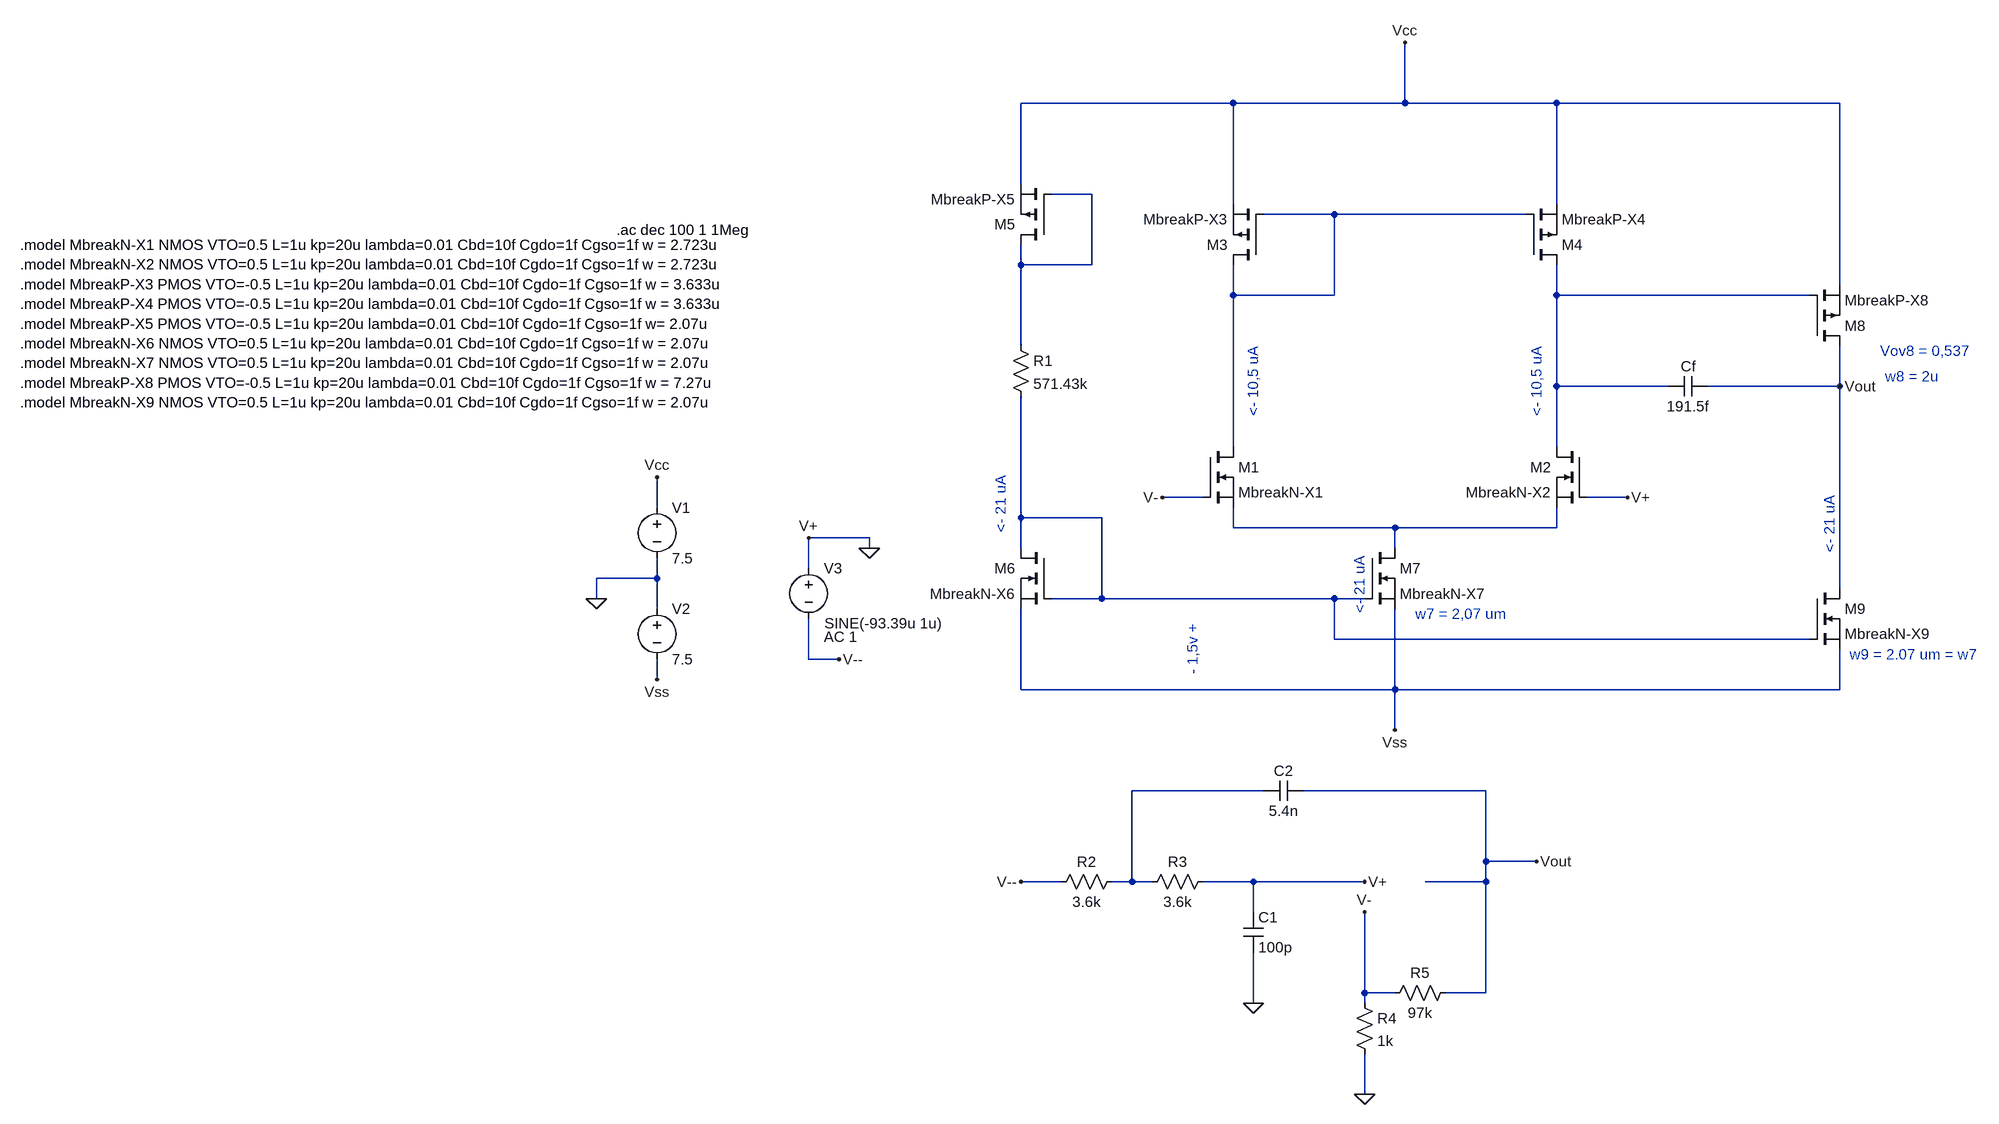
[diagram p0: schematic SIMULAÇÃO-Amp.op.Filtro.asc]
SIMULAÇÃO-Amp.op.Filtro.asc, the LTspice schematic file:
Version 4.1
SHEET 1 3020 948
WIRE 1216 -640 880 -640
WIRE 1488 -640 1488 -736
WIRE 1488 -640 1216 -640
WIRE 1728 -640 1488 -640
WIRE 2176 -640 1728 -640
WIRE 880 -512 880 -640
WIRE 992 -496 928 -496
WIRE 1216 -480 1216 -640
WIRE 1728 -480 1728 -640
WIRE 1376 -464 1264 -464
WIRE 1680 -464 1376 -464
WIRE 880 -384 880 -416
WIRE 992 -384 992 -496
WIRE 992 -384 880 -384
WIRE 2176 -352 2176 -640
WIRE 1216 -336 1216 -384
WIRE 1376 -336 1376 -464
WIRE 1376 -336 1216 -336
WIRE 1728 -336 1728 -384
WIRE 2128 -336 1728 -336
WIRE 880 -256 880 -384
WIRE 1728 -192 1728 -336
WIRE 1904 -192 1728 -192
WIRE 2176 -192 2176 -256
WIRE 2176 -192 1968 -192
WIRE 1216 -96 1216 -336
WIRE 1728 -96 1728 -192
WIRE 1168 -16 1104 -16
WIRE 1840 -16 1776 -16
WIRE 304 0 304 -48
WIRE 880 16 880 -176
WIRE 1008 16 880 16
WIRE 1216 32 1216 0
WIRE 1472 32 1216 32
WIRE 1728 32 1728 0
WIRE 1728 32 1472 32
WIRE 640 48 544 48
WIRE 640 64 640 48
WIRE 880 64 880 16
WIRE 1472 64 1472 32
WIRE 544 96 544 48
WIRE 304 112 304 80
WIRE 304 112 208 112
WIRE 2176 128 2176 -192
WIRE 208 144 208 112
WIRE 1008 144 1008 16
WIRE 1008 144 928 144
WIRE 1376 144 1008 144
WIRE 1424 144 1376 144
WIRE 304 160 304 112
WIRE 1376 208 1376 144
WIRE 2128 208 1376 208
WIRE 544 240 544 176
WIRE 592 240 544 240
WIRE 304 272 304 240
WIRE 880 288 880 160
WIRE 1472 288 1472 160
WIRE 1472 288 880 288
WIRE 2176 288 2176 224
WIRE 2176 288 1472 288
WIRE 1472 352 1472 288
WIRE 1264 448 1056 448
WIRE 1616 448 1328 448
WIRE 1616 560 1616 448
WIRE 1696 560 1616 560
WIRE 944 592 880 592
WIRE 1056 592 1056 448
WIRE 1056 592 1024 592
WIRE 1088 592 1056 592
WIRE 1248 592 1168 592
WIRE 1424 592 1248 592
WIRE 1616 592 1616 560
WIRE 1616 592 1520 592
WIRE 1248 640 1248 592
WIRE 1424 768 1424 640
WIRE 1472 768 1424 768
WIRE 1616 768 1616 592
WIRE 1616 768 1552 768
WIRE 1248 784 1248 704
WIRE 1424 784 1424 768
WIRE 1424 928 1424 864
FLAG 304 -48 Vcc
FLAG 304 272 Vss
FLAG 208 144 0
FLAG 592 240 V--
FLAG 544 48 V+
FLAG 1840 -16 V+
FLAG 1104 -16 V-
FLAG 1488 -736 Vcc
FLAG 1472 352 Vss
FLAG 640 64 0
FLAG 880 592 V--
FLAG 1248 784 0
FLAG 1424 928 0
FLAG 1424 592 V+
FLAG 1424 640 V-
FLAG 2176 -192 Vout
FLAG 1696 560 Vout
DATAFLAG 2176 -160 ""
SYMBOL voltage 304 -16 R0
WINDOW 123 0 0 Left 0
WINDOW 39 0 0 Left 0
SYMATTR InstName V1
SYMATTR Value 7.5
SYMBOL voltage 304 144 R0
WINDOW 123 0 0 Left 0
WINDOW 39 0 0 Left 0
SYMATTR InstName V2
SYMATTR Value 7.5
SYMBOL voltage 544 80 R0
WINDOW 3 25 103 Left 2
WINDOW 123 24 124 Left 2
WINDOW 39 0 0 Left 0
SYMATTR Value SINE(-93.39u 1u)
SYMATTR Value2 AC 1
SYMATTR InstName V3
SYMBOL pmos 928 -416 R180
SYMATTR InstName M5
SYMATTR Value MbreakP-X5
SYMBOL res 864 -272 R0
SYMATTR InstName R1
SYMATTR Value 571.43k
SYMBOL nmos 928 64 M0
SYMATTR InstName M6
SYMATTR Value MbreakN-X6
SYMBOL nmos 1424 64 R0
SYMATTR InstName M7
SYMATTR Value MbreakN-X7
SYMBOL nmos 1168 -96 R0
SYMATTR InstName M1
SYMATTR Value MbreakN-X1
SYMBOL nmos 1776 -96 M0
SYMATTR InstName M2
SYMATTR Value MbreakN-X2
SYMBOL pmos 1264 -384 R180
SYMATTR InstName M3
SYMATTR Value MbreakP-X3
SYMBOL pmos 1680 -384 M180
SYMATTR InstName M4
SYMATTR Value MbreakP-X4
SYMBOL pmos 2128 -256 M180
SYMATTR InstName M8
SYMATTR Value MbreakP-X8
SYMBOL nmos 2128 128 R0
SYMATTR InstName M9
SYMATTR Value MbreakN-X9
SYMBOL cap 1968 -208 R90
WINDOW 0 0 32 VBottom 2
WINDOW 3 32 32 VTop 2
SYMATTR InstName Cf
SYMATTR Value 191.5f
SYMBOL res 1040 576 R90
WINDOW 0 0 56 VBottom 2
WINDOW 3 32 56 VTop 2
SYMATTR InstName R2
SYMATTR Value 3.6k
SYMBOL res 1184 576 R90
WINDOW 0 0 56 VBottom 2
WINDOW 3 32 56 VTop 2
SYMATTR InstName R3
SYMATTR Value 3.6k
SYMBOL cap 1232 640 R0
SYMATTR InstName C1
SYMATTR Value 100p
SYMBOL cap 1328 432 R90
WINDOW 0 0 32 VBottom 2
WINDOW 3 32 32 VTop 2
SYMATTR InstName C2
SYMATTR Value 5.4n
SYMBOL res 1408 768 R0
SYMATTR InstName R4
SYMATTR Value 1k
SYMBOL res 1568 752 R90
WINDOW 0 0 56 VBottom 2
WINDOW 3 32 56 VTop 2
SYMATTR InstName R5
SYMATTR Value 97k
TEXT 1152 264 VLeft 2 ;- 1,5v +
TEXT 1248 -144 VLeft 2 ;<- 10,5 uA
TEXT 848 40 VLeft 2 ;<- 21 uA
TEXT -704 -416 Left 2 !.model MbreakN-X1 NMOS VTO=0.5 L=1u kp=20u lambda=0.01 Cbd=10f Cgdo=1f Cgso=1f w = 2.723u\n.model MbreakN-X2 NMOS VTO=0.5 L=1u kp=20u lambda=0.01 Cbd=10f Cgdo=1f Cgso=1f w = 2.723u\n.model MbreakP-X3 PMOS VTO=-0.5 L=1u kp=20u lambda=0.01 Cbd=10f Cgdo=1f Cgso=1f w = 3.633u\n.model MbreakP-X4 PMOS VTO=-0.5 L=1u kp=20u lambda=0.01 Cbd=10f Cgdo=1f Cgso=1f w = 3.633u\n.model MbreakP-X5 PMOS VTO=-0.5 L=1u kp=20u lambda=0.01 Cbd=10f Cgdo=1f Cgso=1f w= 2.07u\n.model MbreakN-X6 NMOS VTO=0.5 L=1u kp=20u lambda=0.01 Cbd=10f Cgdo=1f Cgso=1f w = 2.07u\n.model MbreakN-X7 NMOS VTO=0.5 L=1u kp=20u lambda=0.01 Cbd=10f Cgdo=1f Cgso=1f w = 2.07u\n.model MbreakP-X8 PMOS VTO=-0.5 L=1u kp=20u lambda=0.01 Cbd=10f Cgdo=1f Cgso=1f w = 7.27u\n.model MbreakN-X9 NMOS VTO=0.5 L=1u kp=20u lambda=0.01 Cbd=10f Cgdo=1f Cgso=1f w = 2.07u
TEXT 2240 -248 Left 2 ;Vov8 = 0,537
TEXT 2160 72 VLeft 2 ;<- 21 uA
TEXT 1504 168 Left 2 ;w7 = 2,07 um
TEXT 2192 232 Left 2 ;w9 = 2.07 um = w7
TEXT 1416 168 VLeft 2 ;<- 21 uA
TEXT 1696 -144 VLeft 2 ;<- 10,5 uA
TEXT 2248 -208 Left 2 ;w8 = 2u
TEXT 240 -440 Left 2 !.ac dec 100 1 1Meg

The netlist it stands for:
* SIMULAÇÃO-Amp.op.Filtro.asc
V1 Vcc 0 7.5
V2 0 Vss 7.5
V3 0 V-- SINE(-93.39u 1u) AC 1
M5 N001 N001 Vcc Vcc MbreakP-X5
R1 N001 N004 571.43k
M6 N004 N004 Vss Vss MbreakN-X6
M7 N005 N004 Vss Vss MbreakN-X7
M1 N002 V- N005 N005 MbreakN-X1
M2 N003 0 N005 N005 MbreakN-X2
M3 N002 N002 Vcc Vcc MbreakP-X3
M4 N003 N002 Vcc Vcc MbreakP-X4
M8 Vout N003 Vcc Vcc MbreakP-X8
M9 Vout N004 Vss Vss MbreakN-X9
Cf Vout N003 191.5f
R2 N006 V-- 3.6k
R3 0 N006 3.6k
C1 0 0 100p
C2 Vout N006 5.4n
R4 V- 0 1k
R5 Vout V- 97k
.model NMOS NMOS
.model PMOS PMOS
.lib standard.mos
* - 1,5v +
* <- 10,5 uA
* <- 21 uA
.model MbreakN-X1 NMOS VTO=0.5 L=1u kp=20u lambda=0.01 Cbd=10f Cgdo=1f Cgso=1f w = 2.723u
.model MbreakN-X2 NMOS VTO=0.5 L=1u kp=20u lambda=0.01 Cbd=10f Cgdo=1f Cgso=1f w = 2.723u
.model MbreakP-X3 PMOS VTO=-0.5 L=1u kp=20u lambda=0.01 Cbd=10f Cgdo=1f Cgso=1f w = 3.633u
.model MbreakP-X4 PMOS VTO=-0.5 L=1u kp=20u lambda=0.01 Cbd=10f Cgdo=1f Cgso=1f w = 3.633u
.model MbreakP-X5 PMOS VTO=-0.5 L=1u kp=20u lambda=0.01 Cbd=10f Cgdo=1f Cgso=1f w= 2.07u
.model MbreakN-X6 NMOS VTO=0.5 L=1u kp=20u lambda=0.01 Cbd=10f Cgdo=1f Cgso=1f w = 2.07u
.model MbreakN-X7 NMOS VTO=0.5 L=1u kp=20u lambda=0.01 Cbd=10f Cgdo=1f Cgso=1f w = 2.07u
.model MbreakP-X8 PMOS VTO=-0.5 L=1u kp=20u lambda=0.01 Cbd=10f Cgdo=1f Cgso=1f w = 7.27u
.model MbreakN-X9 NMOS VTO=0.5 L=1u kp=20u lambda=0.01 Cbd=10f Cgdo=1f Cgso=1f w = 2.07u
* Vov8 = 0,537
* <- 21 uA
* w7 = 2,07 um
* w9 = 2.07 um = w7
* <- 21 uA
* <- 10,5 uA
* w8 = 2u
.ac dec 100 1 1Meg
.backanno
.end